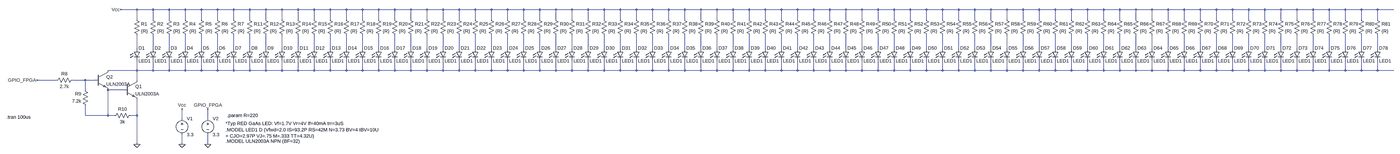
[diagram p0: schematic ULN2003A_test.asc, whole sheet]
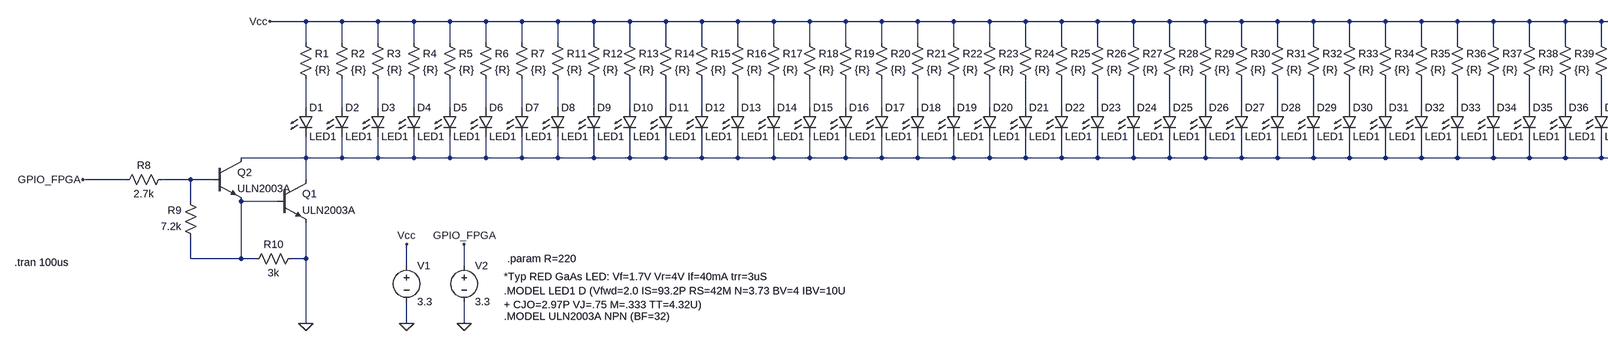
[diagram p1: schematic ULN2003A_test.asc, part, row 1 of 1, column 1 of 2]
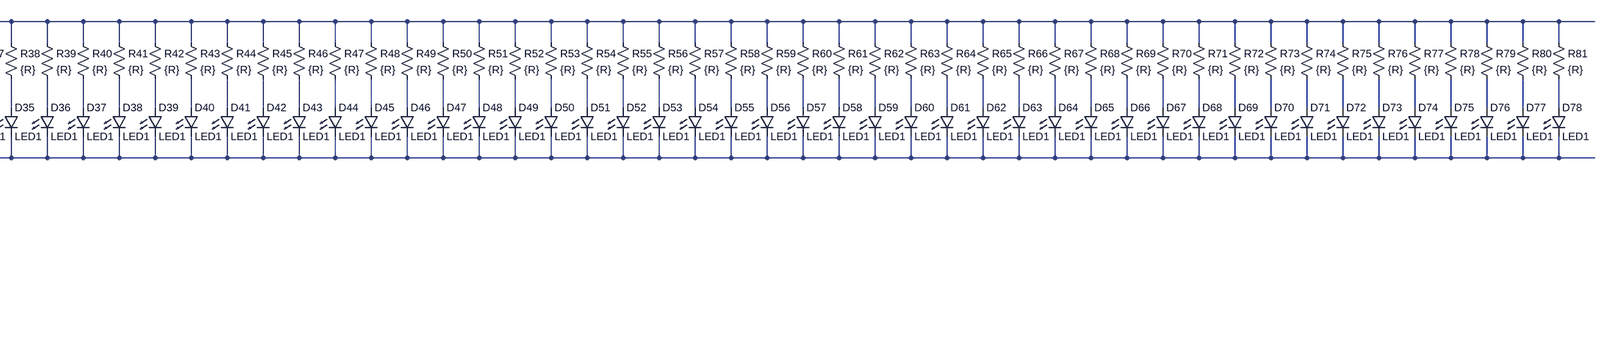
[diagram p2: schematic ULN2003A_test.asc, part, row 1 of 1, column 2 of 2]
ULN2003A_test.asc, the LTspice schematic file:
Version 4
SHEET 1 6612 680
WIRE 208 -256 128 -256
WIRE 288 -256 208 -256
WIRE 368 -256 288 -256
WIRE 448 -256 368 -256
WIRE 528 -256 448 -256
WIRE 608 -256 528 -256
WIRE 688 -256 608 -256
WIRE 768 -256 688 -256
WIRE 848 -256 768 -256
WIRE 928 -256 848 -256
WIRE 1008 -256 928 -256
WIRE 1088 -256 1008 -256
WIRE 1168 -256 1088 -256
WIRE 1248 -256 1168 -256
WIRE 1328 -256 1248 -256
WIRE 1408 -256 1328 -256
WIRE 1488 -256 1408 -256
WIRE 1568 -256 1488 -256
WIRE 1648 -256 1568 -256
WIRE 1728 -256 1648 -256
WIRE 1808 -256 1728 -256
WIRE 1888 -256 1808 -256
WIRE 1968 -256 1888 -256
WIRE 2048 -256 1968 -256
WIRE 2128 -256 2048 -256
WIRE 2208 -256 2128 -256
WIRE 2288 -256 2208 -256
WIRE 2368 -256 2288 -256
WIRE 2448 -256 2368 -256
WIRE 2528 -256 2448 -256
WIRE 2608 -256 2528 -256
WIRE 2688 -256 2608 -256
WIRE 2768 -256 2688 -256
WIRE 2848 -256 2768 -256
WIRE 2928 -256 2848 -256
WIRE 3008 -256 2928 -256
WIRE 3088 -256 3008 -256
WIRE 3168 -256 3088 -256
WIRE 3248 -256 3168 -256
WIRE 3328 -256 3248 -256
WIRE 3408 -256 3328 -256
WIRE 3488 -256 3408 -256
WIRE 3568 -256 3488 -256
WIRE 3648 -256 3568 -256
WIRE 3728 -256 3648 -256
WIRE 3808 -256 3728 -256
WIRE 3888 -256 3808 -256
WIRE 3968 -256 3888 -256
WIRE 4048 -256 3968 -256
WIRE 4128 -256 4048 -256
WIRE 4208 -256 4128 -256
WIRE 4288 -256 4208 -256
WIRE 4368 -256 4288 -256
WIRE 4448 -256 4368 -256
WIRE 4528 -256 4448 -256
WIRE 4608 -256 4528 -256
WIRE 4688 -256 4608 -256
WIRE 4768 -256 4688 -256
WIRE 4848 -256 4768 -256
WIRE 4928 -256 4848 -256
WIRE 5008 -256 4928 -256
WIRE 5088 -256 5008 -256
WIRE 5168 -256 5088 -256
WIRE 5248 -256 5168 -256
WIRE 5328 -256 5248 -256
WIRE 5408 -256 5328 -256
WIRE 5488 -256 5408 -256
WIRE 5568 -256 5488 -256
WIRE 5648 -256 5568 -256
WIRE 5728 -256 5648 -256
WIRE 5808 -256 5728 -256
WIRE 5888 -256 5808 -256
WIRE 5968 -256 5888 -256
WIRE 6048 -256 5968 -256
WIRE 6128 -256 6048 -256
WIRE 6208 -256 6128 -256
WIRE 6288 -256 6208 -256
WIRE 6368 -256 6288 -256
WIRE 6448 -256 6368 -256
WIRE 208 -208 208 -256
WIRE 288 -208 288 -256
WIRE 368 -208 368 -256
WIRE 448 -208 448 -256
WIRE 528 -208 528 -256
WIRE 608 -208 608 -256
WIRE 688 -208 688 -256
WIRE 768 -208 768 -256
WIRE 848 -208 848 -256
WIRE 928 -208 928 -256
WIRE 1008 -208 1008 -256
WIRE 1088 -208 1088 -256
WIRE 1168 -208 1168 -256
WIRE 1248 -208 1248 -256
WIRE 1328 -208 1328 -256
WIRE 1408 -208 1408 -256
WIRE 1488 -208 1488 -256
WIRE 1568 -208 1568 -256
WIRE 1648 -208 1648 -256
WIRE 1728 -208 1728 -256
WIRE 1808 -208 1808 -256
WIRE 1888 -208 1888 -256
WIRE 1968 -208 1968 -256
WIRE 2048 -208 2048 -256
WIRE 2128 -208 2128 -256
WIRE 2208 -208 2208 -256
WIRE 2288 -208 2288 -256
WIRE 2368 -208 2368 -256
WIRE 2448 -208 2448 -256
WIRE 2528 -208 2528 -256
WIRE 2608 -208 2608 -256
WIRE 2688 -208 2688 -256
WIRE 2768 -208 2768 -256
WIRE 2848 -208 2848 -256
WIRE 2928 -208 2928 -256
WIRE 3008 -208 3008 -256
WIRE 3088 -208 3088 -256
WIRE 3168 -208 3168 -256
WIRE 3248 -208 3248 -256
WIRE 3328 -208 3328 -256
WIRE 3408 -208 3408 -256
WIRE 3488 -208 3488 -256
WIRE 3568 -208 3568 -256
WIRE 3648 -208 3648 -256
WIRE 3728 -208 3728 -256
WIRE 3808 -208 3808 -256
WIRE 3888 -208 3888 -256
WIRE 3968 -208 3968 -256
WIRE 4048 -208 4048 -256
WIRE 4128 -208 4128 -256
WIRE 4208 -208 4208 -256
WIRE 4288 -208 4288 -256
WIRE 4368 -208 4368 -256
WIRE 4448 -208 4448 -256
WIRE 4528 -208 4528 -256
WIRE 4608 -208 4608 -256
WIRE 4688 -208 4688 -256
WIRE 4768 -208 4768 -256
WIRE 4848 -208 4848 -256
WIRE 4928 -208 4928 -256
WIRE 5008 -208 5008 -256
WIRE 5088 -208 5088 -256
WIRE 5168 -208 5168 -256
WIRE 5248 -208 5248 -256
WIRE 5328 -208 5328 -256
WIRE 5408 -208 5408 -256
WIRE 5488 -208 5488 -256
WIRE 5568 -208 5568 -256
WIRE 5648 -208 5648 -256
WIRE 5728 -208 5728 -256
WIRE 5808 -208 5808 -256
WIRE 5888 -208 5888 -256
WIRE 5968 -208 5968 -256
WIRE 6048 -208 6048 -256
WIRE 6128 -208 6128 -256
WIRE 6208 -208 6208 -256
WIRE 6288 -208 6288 -256
WIRE 6368 -208 6368 -256
WIRE 208 -64 208 -128
WIRE 288 -64 288 -128
WIRE 368 -64 368 -128
WIRE 448 -64 448 -128
WIRE 528 -64 528 -128
WIRE 608 -64 608 -128
WIRE 688 -64 688 -128
WIRE 768 -64 768 -128
WIRE 848 -64 848 -128
WIRE 928 -64 928 -128
WIRE 1008 -64 1008 -128
WIRE 1088 -64 1088 -128
WIRE 1168 -64 1168 -128
WIRE 1248 -64 1248 -128
WIRE 1328 -64 1328 -128
WIRE 1408 -64 1408 -128
WIRE 1488 -64 1488 -128
WIRE 1568 -64 1568 -128
WIRE 1648 -64 1648 -128
WIRE 1728 -64 1728 -128
WIRE 1808 -64 1808 -128
WIRE 1888 -64 1888 -128
WIRE 1968 -64 1968 -128
WIRE 2048 -64 2048 -128
WIRE 2128 -64 2128 -128
WIRE 2208 -64 2208 -128
WIRE 2288 -64 2288 -128
WIRE 2368 -64 2368 -128
WIRE 2448 -64 2448 -128
WIRE 2528 -64 2528 -128
WIRE 2608 -64 2608 -128
WIRE 2688 -64 2688 -128
WIRE 2768 -64 2768 -128
WIRE 2848 -64 2848 -128
WIRE 2928 -64 2928 -128
WIRE 3008 -64 3008 -128
WIRE 3088 -64 3088 -128
WIRE 3168 -64 3168 -128
WIRE 3248 -64 3248 -128
WIRE 3328 -64 3328 -128
WIRE 3408 -64 3408 -128
WIRE 3488 -64 3488 -128
WIRE 3568 -64 3568 -128
WIRE 3648 -64 3648 -128
WIRE 3728 -64 3728 -128
WIRE 3808 -64 3808 -128
WIRE 3888 -64 3888 -128
WIRE 3968 -64 3968 -128
WIRE 4048 -64 4048 -128
WIRE 4128 -64 4128 -128
WIRE 4208 -64 4208 -128
WIRE 4288 -64 4288 -128
WIRE 4368 -64 4368 -128
WIRE 4448 -64 4448 -128
WIRE 4528 -64 4528 -128
WIRE 4608 -64 4608 -128
WIRE 4688 -64 4688 -128
WIRE 4768 -64 4768 -128
WIRE 4848 -64 4848 -128
WIRE 4928 -64 4928 -128
WIRE 5008 -64 5008 -128
WIRE 5088 -64 5088 -128
WIRE 5168 -64 5168 -128
WIRE 5248 -64 5248 -128
WIRE 5328 -64 5328 -128
WIRE 5408 -64 5408 -128
WIRE 5488 -64 5488 -128
WIRE 5568 -64 5568 -128
WIRE 5648 -64 5648 -128
WIRE 5728 -64 5728 -128
WIRE 5808 -64 5808 -128
WIRE 5888 -64 5888 -128
WIRE 5968 -64 5968 -128
WIRE 6048 -64 6048 -128
WIRE 6128 -64 6128 -128
WIRE 6208 -64 6208 -128
WIRE 6288 -64 6288 -128
WIRE 6368 -64 6368 -128
WIRE 208 48 208 0
WIRE 208 48 64 48
WIRE 288 48 288 0
WIRE 288 48 208 48
WIRE 368 48 368 0
WIRE 368 48 288 48
WIRE 448 48 448 0
WIRE 448 48 368 48
WIRE 528 48 528 0
WIRE 528 48 448 48
WIRE 608 48 608 0
WIRE 608 48 528 48
WIRE 688 48 688 0
WIRE 688 48 608 48
WIRE 768 48 768 0
WIRE 768 48 688 48
WIRE 848 48 848 0
WIRE 848 48 768 48
WIRE 928 48 928 0
WIRE 928 48 848 48
WIRE 1008 48 1008 0
WIRE 1008 48 928 48
WIRE 1088 48 1088 0
WIRE 1088 48 1008 48
WIRE 1168 48 1168 0
WIRE 1168 48 1088 48
WIRE 1248 48 1248 0
WIRE 1248 48 1168 48
WIRE 1328 48 1328 0
WIRE 1328 48 1248 48
WIRE 1408 48 1408 0
WIRE 1408 48 1328 48
WIRE 1488 48 1488 0
WIRE 1488 48 1408 48
WIRE 1568 48 1568 0
WIRE 1568 48 1488 48
WIRE 1648 48 1648 0
WIRE 1648 48 1568 48
WIRE 1728 48 1728 0
WIRE 1728 48 1648 48
WIRE 1808 48 1808 0
WIRE 1808 48 1728 48
WIRE 1888 48 1888 0
WIRE 1888 48 1808 48
WIRE 1968 48 1968 0
WIRE 1968 48 1888 48
WIRE 2048 48 2048 0
WIRE 2048 48 1968 48
WIRE 2128 48 2128 0
WIRE 2128 48 2048 48
WIRE 2208 48 2208 0
WIRE 2208 48 2128 48
WIRE 2288 48 2288 0
WIRE 2288 48 2208 48
WIRE 2368 48 2368 0
WIRE 2368 48 2288 48
WIRE 2448 48 2448 0
WIRE 2448 48 2368 48
WIRE 2528 48 2528 0
WIRE 2528 48 2448 48
WIRE 2608 48 2608 0
WIRE 2608 48 2528 48
WIRE 2688 48 2688 0
WIRE 2688 48 2608 48
WIRE 2768 48 2768 0
WIRE 2768 48 2688 48
WIRE 2848 48 2848 0
WIRE 2848 48 2768 48
WIRE 2928 48 2928 0
WIRE 2928 48 2848 48
WIRE 3008 48 3008 0
WIRE 3008 48 2928 48
WIRE 3088 48 3088 0
WIRE 3088 48 3008 48
WIRE 3168 48 3168 0
WIRE 3168 48 3088 48
WIRE 3248 48 3248 0
WIRE 3248 48 3168 48
WIRE 3328 48 3328 0
WIRE 3328 48 3248 48
WIRE 3408 48 3408 0
WIRE 3408 48 3328 48
WIRE 3488 48 3488 0
WIRE 3488 48 3408 48
WIRE 3568 48 3568 0
WIRE 3568 48 3488 48
WIRE 3648 48 3648 0
WIRE 3648 48 3568 48
WIRE 3728 48 3728 0
WIRE 3728 48 3648 48
WIRE 3808 48 3808 0
WIRE 3808 48 3728 48
WIRE 3888 48 3888 0
WIRE 3888 48 3808 48
WIRE 3968 48 3968 0
WIRE 3968 48 3888 48
WIRE 4048 48 4048 0
WIRE 4048 48 3968 48
WIRE 4128 48 4128 0
WIRE 4128 48 4048 48
WIRE 4208 48 4208 0
WIRE 4208 48 4128 48
WIRE 4288 48 4288 0
WIRE 4288 48 4208 48
WIRE 4368 48 4368 0
WIRE 4368 48 4288 48
WIRE 4448 48 4448 0
WIRE 4448 48 4368 48
WIRE 4528 48 4528 0
WIRE 4528 48 4448 48
WIRE 4608 48 4608 0
WIRE 4608 48 4528 48
WIRE 4688 48 4688 0
WIRE 4688 48 4608 48
WIRE 4768 48 4768 0
WIRE 4768 48 4688 48
WIRE 4848 48 4848 0
WIRE 4848 48 4768 48
WIRE 4928 48 4928 0
WIRE 4928 48 4848 48
WIRE 5008 48 5008 0
WIRE 5008 48 4928 48
WIRE 5088 48 5088 0
WIRE 5088 48 5008 48
WIRE 5168 48 5168 0
WIRE 5168 48 5088 48
WIRE 5248 48 5248 0
WIRE 5248 48 5168 48
WIRE 5328 48 5328 0
WIRE 5328 48 5248 48
WIRE 5408 48 5408 0
WIRE 5408 48 5328 48
WIRE 5488 48 5488 0
WIRE 5488 48 5408 48
WIRE 5568 48 5568 0
WIRE 5568 48 5488 48
WIRE 5648 48 5648 0
WIRE 5648 48 5568 48
WIRE 5728 48 5728 0
WIRE 5728 48 5648 48
WIRE 5808 48 5808 0
WIRE 5808 48 5728 48
WIRE 5888 48 5888 0
WIRE 5888 48 5808 48
WIRE 5968 48 5968 0
WIRE 5968 48 5888 48
WIRE 6048 48 6048 0
WIRE 6048 48 5968 48
WIRE 6128 48 6128 0
WIRE 6128 48 6048 48
WIRE 6208 48 6208 0
WIRE 6208 48 6128 48
WIRE 6288 48 6288 0
WIRE 6288 48 6208 48
WIRE 6368 48 6368 0
WIRE 6368 48 6288 48
WIRE 6448 48 6368 48
WIRE -192 96 -288 96
WIRE -48 96 -112 96
WIRE 0 96 -48 96
WIRE 208 96 208 48
WIRE -48 144 -48 96
WIRE 144 144 64 144
WIRE -48 272 -48 224
WIRE 64 272 64 144
WIRE 64 272 -48 272
WIRE 96 272 64 272
WIRE 208 272 208 192
WIRE 208 272 176 272
WIRE 432 288 432 240
WIRE 560 288 560 240
WIRE 208 416 208 272
WIRE 432 416 432 368
WIRE 560 416 560 368
FLAG 208 416 0
FLAG -288 96 GPIO_FPGA
FLAG 128 -256 Vcc
FLAG 432 416 0
FLAG 432 240 Vcc
FLAG 560 416 0
FLAG 560 240 GPIO_FPGA
SYMBOL npn 144 96 R0
SYMATTR InstName Q1
SYMATTR Value ULN2003A
SYMBOL LED 192 -64 R0
SYMATTR InstName D1
SYMATTR Value LED1
SYMBOL LED 272 -64 R0
SYMATTR InstName D2
SYMATTR Value LED1
SYMBOL LED 352 -64 R0
SYMATTR InstName D3
SYMATTR Value LED1
SYMBOL LED 432 -64 R0
SYMATTR InstName D4
SYMATTR Value LED1
SYMBOL LED 512 -64 R0
SYMATTR InstName D5
SYMATTR Value LED1
SYMBOL LED 592 -64 R0
SYMATTR InstName D6
SYMATTR Value LED1
SYMBOL LED 672 -64 R0
SYMATTR InstName D7
SYMATTR Value LED1
SYMBOL res 192 -224 R0
SYMATTR InstName R1
SYMATTR Value {R}
SYMBOL res 272 -224 R0
SYMATTR InstName R2
SYMATTR Value {R}
SYMBOL res 352 -224 R0
SYMATTR InstName R3
SYMATTR Value {R}
SYMBOL res 432 -224 R0
SYMATTR InstName R4
SYMATTR Value {R}
SYMBOL res 512 -224 R0
SYMATTR InstName R5
SYMATTR Value {R}
SYMBOL res 592 -224 R0
SYMATTR InstName R6
SYMATTR Value {R}
SYMBOL res 672 -224 R0
SYMATTR InstName R7
SYMATTR Value {R}
SYMBOL res -96 80 R90
WINDOW 0 0 56 VBottom 2
WINDOW 3 32 56 VTop 2
SYMATTR InstName R8
SYMATTR Value 2.7k
SYMBOL res -32 240 R180
WINDOW 0 36 76 Left 2
WINDOW 3 36 40 Left 2
SYMATTR InstName R9
SYMATTR Value 7.2k
SYMBOL voltage 432 272 R0
WINDOW 123 0 0 Left 0
WINDOW 39 0 0 Left 0
SYMATTR InstName V1
SYMATTR Value 3.3
SYMBOL voltage 560 272 R0
WINDOW 123 0 0 Left 0
WINDOW 39 0 0 Left 0
SYMATTR InstName V2
SYMATTR Value 3.3
SYMBOL npn 0 48 R0
SYMATTR InstName Q2
SYMATTR Value ULN2003A
SYMBOL res 192 256 R90
WINDOW 0 0 56 VBottom 2
WINDOW 3 32 56 VTop 2
SYMATTR InstName R10
SYMATTR Value 3k
SYMBOL LED 752 -64 R0
SYMATTR InstName D8
SYMATTR Value LED1
SYMBOL LED 832 -64 R0
SYMATTR InstName D9
SYMATTR Value LED1
SYMBOL LED 912 -64 R0
SYMATTR InstName D10
SYMATTR Value LED1
SYMBOL LED 992 -64 R0
SYMATTR InstName D11
SYMATTR Value LED1
SYMBOL LED 1072 -64 R0
SYMATTR InstName D12
SYMATTR Value LED1
SYMBOL LED 1152 -64 R0
SYMATTR InstName D13
SYMATTR Value LED1
SYMBOL res 752 -224 R0
SYMATTR InstName R11
SYMATTR Value {R}
SYMBOL res 832 -224 R0
SYMATTR InstName R12
SYMATTR Value {R}
SYMBOL res 912 -224 R0
SYMATTR InstName R13
SYMATTR Value {R}
SYMBOL res 992 -224 R0
SYMATTR InstName R14
SYMATTR Value {R}
SYMBOL res 1072 -224 R0
SYMATTR InstName R15
SYMATTR Value {R}
SYMBOL res 1152 -224 R0
SYMATTR InstName R16
SYMATTR Value {R}
SYMBOL LED 1232 -64 R0
SYMATTR InstName D14
SYMATTR Value LED1
SYMBOL LED 1312 -64 R0
SYMATTR InstName D15
SYMATTR Value LED1
SYMBOL LED 1392 -64 R0
SYMATTR InstName D16
SYMATTR Value LED1
SYMBOL LED 1472 -64 R0
SYMATTR InstName D17
SYMATTR Value LED1
SYMBOL LED 1552 -64 R0
SYMATTR InstName D18
SYMATTR Value LED1
SYMBOL LED 1632 -64 R0
SYMATTR InstName D19
SYMATTR Value LED1
SYMBOL LED 1712 -64 R0
SYMATTR InstName D20
SYMATTR Value LED1
SYMBOL res 1232 -224 R0
SYMATTR InstName R17
SYMATTR Value {R}
SYMBOL res 1312 -224 R0
SYMATTR InstName R18
SYMATTR Value {R}
SYMBOL res 1392 -224 R0
SYMATTR InstName R19
SYMATTR Value {R}
SYMBOL res 1472 -224 R0
SYMATTR InstName R20
SYMATTR Value {R}
SYMBOL res 1552 -224 R0
SYMATTR InstName R21
SYMATTR Value {R}
SYMBOL res 1632 -224 R0
SYMATTR InstName R22
SYMATTR Value {R}
SYMBOL res 1712 -224 R0
SYMATTR InstName R23
SYMATTR Value {R}
SYMBOL LED 1792 -64 R0
SYMATTR InstName D21
SYMATTR Value LED1
SYMBOL LED 1872 -64 R0
SYMATTR InstName D22
SYMATTR Value LED1
SYMBOL LED 1952 -64 R0
SYMATTR InstName D23
SYMATTR Value LED1
SYMBOL LED 2032 -64 R0
SYMATTR InstName D24
SYMATTR Value LED1
SYMBOL LED 2112 -64 R0
SYMATTR InstName D25
SYMATTR Value LED1
SYMBOL LED 2192 -64 R0
SYMATTR InstName D26
SYMATTR Value LED1
SYMBOL res 1792 -224 R0
SYMATTR InstName R24
SYMATTR Value {R}
SYMBOL res 1872 -224 R0
SYMATTR InstName R25
SYMATTR Value {R}
SYMBOL res 1952 -224 R0
SYMATTR InstName R26
SYMATTR Value {R}
SYMBOL res 2032 -224 R0
SYMATTR InstName R27
SYMATTR Value {R}
SYMBOL res 2112 -224 R0
SYMATTR InstName R28
SYMATTR Value {R}
SYMBOL res 2192 -224 R0
SYMATTR InstName R29
SYMATTR Value {R}
SYMBOL LED 2272 -64 R0
SYMATTR InstName D27
SYMATTR Value LED1
SYMBOL LED 2352 -64 R0
SYMATTR InstName D28
SYMATTR Value LED1
SYMBOL LED 2432 -64 R0
SYMATTR InstName D29
SYMATTR Value LED1
SYMBOL LED 2512 -64 R0
SYMATTR InstName D30
SYMATTR Value LED1
SYMBOL LED 2592 -64 R0
SYMATTR InstName D31
SYMATTR Value LED1
SYMBOL LED 2672 -64 R0
SYMATTR InstName D32
SYMATTR Value LED1
SYMBOL LED 2752 -64 R0
SYMATTR InstName D33
SYMATTR Value LED1
SYMBOL res 2272 -224 R0
SYMATTR InstName R30
SYMATTR Value {R}
SYMBOL res 2352 -224 R0
SYMATTR InstName R31
SYMATTR Value {R}
SYMBOL res 2432 -224 R0
SYMATTR InstName R32
SYMATTR Value {R}
SYMBOL res 2512 -224 R0
SYMATTR InstName R33
SYMATTR Value {R}
SYMBOL res 2592 -224 R0
SYMATTR InstName R34
SYMATTR Value {R}
SYMBOL res 2672 -224 R0
SYMATTR InstName R35
SYMATTR Value {R}
SYMBOL res 2752 -224 R0
SYMATTR InstName R36
SYMATTR Value {R}
SYMBOL LED 2832 -64 R0
SYMATTR InstName D34
SYMATTR Value LED1
SYMBOL LED 2912 -64 R0
SYMATTR InstName D35
SYMATTR Value LED1
SYMBOL LED 2992 -64 R0
SYMATTR InstName D36
SYMATTR Value LED1
SYMBOL LED 3072 -64 R0
SYMATTR InstName D37
SYMATTR Value LED1
SYMBOL LED 3152 -64 R0
SYMATTR InstName D38
SYMATTR Value LED1
SYMBOL LED 3232 -64 R0
SYMATTR InstName D39
SYMATTR Value LED1
SYMBOL res 2832 -224 R0
SYMATTR InstName R37
SYMATTR Value {R}
SYMBOL res 2912 -224 R0
SYMATTR InstName R38
SYMATTR Value {R}
SYMBOL res 2992 -224 R0
SYMATTR InstName R39
SYMATTR Value {R}
SYMBOL res 3072 -224 R0
SYMATTR InstName R40
SYMATTR Value {R}
SYMBOL res 3152 -224 R0
SYMATTR InstName R41
SYMATTR Value {R}
SYMBOL res 3232 -224 R0
SYMATTR InstName R42
SYMATTR Value {R}
SYMBOL LED 3312 -64 R0
SYMATTR InstName D40
SYMATTR Value LED1
SYMBOL LED 3392 -64 R0
SYMATTR InstName D41
SYMATTR Value LED1
SYMBOL LED 3472 -64 R0
SYMATTR InstName D42
SYMATTR Value LED1
SYMBOL LED 3552 -64 R0
SYMATTR InstName D43
SYMATTR Value LED1
SYMBOL LED 3632 -64 R0
SYMATTR InstName D44
SYMATTR Value LED1
SYMBOL LED 3712 -64 R0
SYMATTR InstName D45
SYMATTR Value LED1
SYMBOL LED 3792 -64 R0
SYMATTR InstName D46
SYMATTR Value LED1
SYMBOL res 3312 -224 R0
SYMATTR InstName R43
SYMATTR Value {R}
SYMBOL res 3392 -224 R0
SYMATTR InstName R44
SYMATTR Value {R}
SYMBOL res 3472 -224 R0
SYMATTR InstName R45
SYMATTR Value {R}
SYMBOL res 3552 -224 R0
SYMATTR InstName R46
SYMATTR Value {R}
SYMBOL res 3632 -224 R0
SYMATTR InstName R47
SYMATTR Value {R}
SYMBOL res 3712 -224 R0
SYMATTR InstName R48
SYMATTR Value {R}
SYMBOL res 3792 -224 R0
SYMATTR InstName R49
SYMATTR Value {R}
SYMBOL LED 3872 -64 R0
SYMATTR InstName D47
SYMATTR Value LED1
SYMBOL LED 3952 -64 R0
SYMATTR InstName D48
SYMATTR Value LED1
SYMBOL LED 4032 -64 R0
SYMATTR InstName D49
SYMATTR Value LED1
SYMBOL LED 4112 -64 R0
SYMATTR InstName D50
SYMATTR Value LED1
SYMBOL LED 4192 -64 R0
SYMATTR InstName D51
SYMATTR Value LED1
SYMBOL LED 4272 -64 R0
SYMATTR InstName D52
SYMATTR Value LED1
SYMBOL res 3872 -224 R0
SYMATTR InstName R50
SYMATTR Value {R}
SYMBOL res 3952 -224 R0
SYMATTR InstName R51
SYMATTR Value {R}
SYMBOL res 4032 -224 R0
SYMATTR InstName R52
SYMATTR Value {R}
SYMBOL res 4112 -224 R0
SYMATTR InstName R53
SYMATTR Value {R}
SYMBOL res 4192 -224 R0
SYMATTR InstName R54
SYMATTR Value {R}
SYMBOL res 4272 -224 R0
SYMATTR InstName R55
SYMATTR Value {R}
SYMBOL LED 4352 -64 R0
SYMATTR InstName D53
SYMATTR Value LED1
SYMBOL LED 4432 -64 R0
SYMATTR InstName D54
SYMATTR Value LED1
SYMBOL LED 4512 -64 R0
SYMATTR InstName D55
SYMATTR Value LED1
SYMBOL res 4352 -224 R0
SYMATTR InstName R56
SYMATTR Value {R}
SYMBOL res 4432 -224 R0
SYMATTR InstName R57
SYMATTR Value {R}
SYMBOL res 4512 -224 R0
SYMATTR InstName R58
SYMATTR Value {R}
SYMBOL LED 4592 -64 R0
SYMATTR InstName D56
SYMATTR Value LED1
SYMBOL LED 4672 -64 R0
SYMATTR InstName D57
SYMATTR Value LED1
SYMBOL LED 4752 -64 R0
SYMATTR InstName D58
SYMATTR Value LED1
SYMBOL LED 4832 -64 R0
SYMATTR InstName D59
SYMATTR Value LED1
SYMBOL LED 4912 -64 R0
SYMATTR InstName D60
SYMATTR Value LED1
SYMBOL res 4592 -224 R0
SYMATTR InstName R59
SYMATTR Value {R}
SYMBOL res 4672 -224 R0
SYMATTR InstName R60
SYMATTR Value {R}
SYMBOL res 4752 -224 R0
SYMATTR InstName R61
SYMATTR Value {R}
SYMBOL res 4832 -224 R0
SYMATTR InstName R62
SYMATTR Value {R}
SYMBOL res 4912 -224 R0
SYMATTR InstName R63
SYMATTR Value {R}
SYMBOL LED 4992 -64 R0
SYMATTR InstName D61
SYMATTR Value LED1
SYMBOL LED 5072 -64 R0
SYMATTR InstName D62
SYMATTR Value LED1
SYMBOL res 4992 -224 R0
SYMATTR InstName R64
SYMATTR Value {R}
SYMBOL res 5072 -224 R0
SYMATTR InstName R65
SYMATTR Value {R}
SYMBOL LED 5152 -64 R0
SYMATTR InstName D63
SYMATTR Value LED1
SYMBOL LED 5232 -64 R0
SYMATTR InstName D64
SYMATTR Value LED1
SYMBOL LED 5312 -64 R0
SYMATTR InstName D65
SYMATTR Value LED1
SYMBOL res 5152 -224 R0
SYMATTR InstName R66
SYMATTR Value {R}
SYMBOL res 5232 -224 R0
SYMATTR InstName R67
SYMATTR Value {R}
SYMBOL res 5312 -224 R0
SYMATTR InstName R68
SYMATTR Value {R}
SYMBOL LED 5392 -64 R0
SYMATTR InstName D66
SYMATTR Value LED1
SYMBOL LED 5472 -64 R0
SYMATTR InstName D67
SYMATTR Value LED1
SYMBOL LED 5552 -64 R0
SYMATTR InstName D68
SYMATTR Value LED1
SYMBOL LED 5632 -64 R0
SYMATTR InstName D69
SYMATTR Value LED1
SYMBOL LED 5712 -64 R0
SYMATTR InstName D70
SYMATTR Value LED1
SYMBOL res 5392 -224 R0
SYMATTR InstName R69
SYMATTR Value {R}
SYMBOL res 5472 -224 R0
SYMATTR InstName R70
SYMATTR Value {R}
SYMBOL res 5552 -224 R0
SYMATTR InstName R71
SYMATTR Value {R}
SYMBOL res 5632 -224 R0
SYMATTR InstName R72
SYMATTR Value {R}
SYMBOL res 5712 -224 R0
SYMATTR InstName R73
SYMATTR Value {R}
SYMBOL LED 5792 -64 R0
SYMATTR InstName D71
SYMATTR Value LED1
SYMBOL LED 5872 -64 R0
SYMATTR InstName D72
SYMATTR Value LED1
SYMBOL res 5792 -224 R0
SYMATTR InstName R74
SYMATTR Value {R}
SYMBOL res 5872 -224 R0
SYMATTR InstName R75
SYMATTR Value {R}
SYMBOL LED 5952 -64 R0
SYMATTR InstName D73
SYMATTR Value LED1
SYMBOL LED 6032 -64 R0
SYMATTR InstName D74
SYMATTR Value LED1
SYMBOL LED 6112 -64 R0
SYMATTR InstName D75
SYMATTR Value LED1
SYMBOL res 5952 -224 R0
SYMATTR InstName R76
SYMATTR Value {R}
SYMBOL res 6032 -224 R0
SYMATTR InstName R77
SYMATTR Value {R}
SYMBOL res 6112 -224 R0
SYMATTR InstName R78
SYMATTR Value {R}
SYMBOL LED 6192 -64 R0
SYMATTR InstName D76
SYMATTR Value LED1
SYMBOL LED 6272 -64 R0
SYMATTR InstName D77
SYMATTR Value LED1
SYMBOL LED 6352 -64 R0
SYMATTR InstName D78
SYMATTR Value LED1
SYMBOL res 6192 -224 R0
SYMATTR InstName R79
SYMATTR Value {R}
SYMBOL res 6272 -224 R0
SYMATTR InstName R80
SYMATTR Value {R}
SYMBOL res 6352 -224 R0
SYMATTR InstName R81
SYMATTR Value {R}
TEXT 656 272 Left 2 !.param R=220
TEXT -440 280 Left 2 !.tran 100us
TEXT 648 312 Left 2 !*Typ RED GaAs LED: Vf=1.7V Vr=4V If=40mA trr=3uS\n.MODEL LED1 D (Vfwd=2.0 IS=93.2P RS=42M N=3.73 BV=4 IBV=10U\n+ CJO=2.97P VJ=.75 M=.333 TT=4.32U)
TEXT 648 400 Left 2 !.MODEL ULN2003A NPN (BF=32)

The netlist it stands for:
* ULN2003A_test.asc
Q1 N079 N081 0 0 ULN2003A
D1 N001 N079 LED1
D2 N002 N079 LED1
D3 N003 N079 LED1
D4 N004 N079 LED1
D5 N005 N079 LED1
D6 N006 N079 LED1
D7 N007 N079 LED1
R1 Vcc N001 {R}
R2 Vcc N002 {R}
R3 Vcc N003 {R}
R4 Vcc N004 {R}
R5 Vcc N005 {R}
R6 Vcc N006 {R}
R7 Vcc N007 {R}
R8 N080 GPIO_FPGA 2.7k
R9 N081 N080 7.2k
V1 Vcc 0 3.3
V2 GPIO_FPGA 0 3.3
Q2 N079 N080 N081 0 ULN2003A
R10 0 N081 3k
D8 N008 N079 LED1
D9 N009 N079 LED1
D10 N010 N079 LED1
D11 N011 N079 LED1
D12 N012 N079 LED1
D13 N013 N079 LED1
R11 Vcc N008 {R}
R12 Vcc N009 {R}
R13 Vcc N010 {R}
R14 Vcc N011 {R}
R15 Vcc N012 {R}
R16 Vcc N013 {R}
D14 N014 N079 LED1
D15 N015 N079 LED1
D16 N016 N079 LED1
D17 N017 N079 LED1
D18 N018 N079 LED1
D19 N019 N079 LED1
D20 N020 N079 LED1
R17 Vcc N014 {R}
R18 Vcc N015 {R}
R19 Vcc N016 {R}
R20 Vcc N017 {R}
R21 Vcc N018 {R}
R22 Vcc N019 {R}
R23 Vcc N020 {R}
D21 N021 N079 LED1
D22 N022 N079 LED1
D23 N023 N079 LED1
D24 N024 N079 LED1
D25 N025 N079 LED1
D26 N026 N079 LED1
R24 Vcc N021 {R}
R25 Vcc N022 {R}
R26 Vcc N023 {R}
R27 Vcc N024 {R}
R28 Vcc N025 {R}
R29 Vcc N026 {R}
D27 N027 N079 LED1
D28 N028 N079 LED1
D29 N029 N079 LED1
D30 N030 N079 LED1
D31 N031 N079 LED1
D32 N032 N079 LED1
D33 N033 N079 LED1
R30 Vcc N027 {R}
R31 Vcc N028 {R}
R32 Vcc N029 {R}
R33 Vcc N030 {R}
R34 Vcc N031 {R}
R35 Vcc N032 {R}
R36 Vcc N033 {R}
D34 N034 N079 LED1
D35 N035 N079 LED1
D36 N036 N079 LED1
D37 N037 N079 LED1
D38 N038 N079 LED1
D39 N039 N079 LED1
R37 Vcc N034 {R}
R38 Vcc N035 {R}
R39 Vcc N036 {R}
R40 Vcc N037 {R}
R41 Vcc N038 {R}
R42 Vcc N039 {R}
D40 N040 N079 LED1
D41 N041 N079 LED1
D42 N042 N079 LED1
D43 N043 N079 LED1
D44 N044 N079 LED1
D45 N045 N079 LED1
D46 N046 N079 LED1
R43 Vcc N040 {R}
R44 Vcc N041 {R}
R45 Vcc N042 {R}
R46 Vcc N043 {R}
R47 Vcc N044 {R}
R48 Vcc N045 {R}
R49 Vcc N046 {R}
D47 N047 N079 LED1
D48 N048 N079 LED1
D49 N049 N079 LED1
D50 N050 N079 LED1
D51 N051 N079 LED1
D52 N052 N079 LED1
R50 Vcc N047 {R}
R51 Vcc N048 {R}
R52 Vcc N049 {R}
R53 Vcc N050 {R}
R54 Vcc N051 {R}
R55 Vcc N052 {R}
D53 N053 N079 LED1
D54 N054 N079 LED1
D55 N055 N079 LED1
R56 Vcc N053 {R}
R57 Vcc N054 {R}
R58 Vcc N055 {R}
D56 N056 N079 LED1
D57 N057 N079 LED1
D58 N058 N079 LED1
D59 N059 N079 LED1
D60 N060 N079 LED1
R59 Vcc N056 {R}
R60 Vcc N057 {R}
R61 Vcc N058 {R}
R62 Vcc N059 {R}
R63 Vcc N060 {R}
D61 N061 N079 LED1
D62 N062 N079 LED1
R64 Vcc N061 {R}
R65 Vcc N062 {R}
D63 N063 N079 LED1
D64 N064 N079 LED1
D65 N065 N079 LED1
R66 Vcc N063 {R}
R67 Vcc N064 {R}
R68 Vcc N065 {R}
D66 N066 N079 LED1
D67 N067 N079 LED1
D68 N068 N079 LED1
D69 N069 N079 LED1
D70 N070 N079 LED1
R69 Vcc N066 {R}
R70 Vcc N067 {R}
R71 Vcc N068 {R}
R72 Vcc N069 {R}
R73 Vcc N070 {R}
D71 N071 N079 LED1
D72 N072 N079 LED1
R74 Vcc N071 {R}
R75 Vcc N072 {R}
D73 N073 N079 LED1
D74 N074 N079 LED1
D75 N075 N079 LED1
R76 Vcc N073 {R}
R77 Vcc N074 {R}
R78 Vcc N075 {R}
D76 N076 N079 LED1
D77 N077 N079 LED1
D78 N078 N079 LED1
R79 Vcc N076 {R}
R80 Vcc N077 {R}
R81 Vcc N078 {R}
.model D D
.lib standard.dio
.model NPN NPN
.model PNP PNP
.lib standard.bjt
.param R=220
.tran 100us
*Typ RED GaAs LED: Vf=1.7V Vr=4V If=40mA trr=3uS
.MODEL LED1 D (Vfwd=2.0 IS=93.2P RS=42M N=3.73 BV=4 IBV=10U
+ CJO=2.97P VJ=.75 M=.333 TT=4.32U)
.MODEL ULN2003A NPN (BF=32)
.backanno
.end